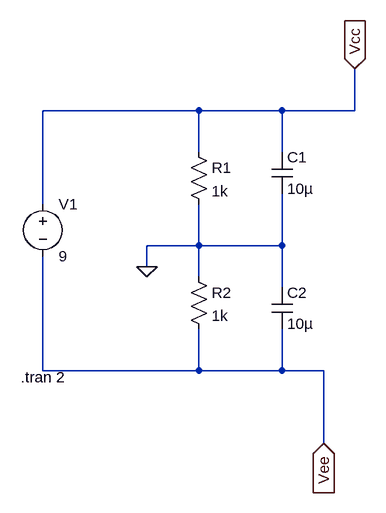
[diagram p0: schematic Power Circuit.asc]
Power Circuit.asc, the LTspice schematic file:
Version 4
SHEET 1 880 680
WIRE 336 -16 96 -16
WIRE 464 -16 336 -16
WIRE 576 -16 576 -80
WIRE 576 -16 464 -16
WIRE 336 48 336 -16
WIRE 464 48 464 -16
WIRE 96 128 96 -16
WIRE 336 192 336 128
WIRE 336 192 256 192
WIRE 464 192 464 112
WIRE 464 192 336 192
WIRE 256 224 256 192
WIRE 336 240 336 192
WIRE 464 256 464 192
WIRE 96 384 96 208
WIRE 336 384 336 320
WIRE 336 384 96 384
WIRE 464 384 464 320
WIRE 464 384 336 384
WIRE 528 384 464 384
WIRE 528 496 528 384
FLAG 256 224 0
FLAG 576 -80 Vcc
IOPIN 576 -80 In
FLAG 528 496 Vee
IOPIN 528 496 In
SYMBOL voltage 96 112 R0
WINDOW 123 0 0 Left 2
WINDOW 39 0 0 Left 2
SYMATTR InstName V1
SYMATTR Value 9
SYMBOL res 320 32 R0
SYMATTR InstName R1
SYMATTR Value 1k
SYMBOL res 320 224 R0
SYMATTR InstName R2
SYMATTR Value 1k
SYMBOL cap 448 48 R0
SYMATTR InstName C1
SYMATTR Value 10µ
SYMBOL cap 448 256 R0
SYMATTR InstName C2
SYMATTR Value 10µ
TEXT 62 394 Left 2 !.tran 2

The netlist it stands for:
* Power Circuit.asc
V1 Vcc Vee 9
R1 Vcc 0 1k
R2 0 Vee 1k
C1 Vcc 0 10µ
C2 0 Vee 10µ
.tran 2
.backanno
.end